# Altium project 手柄.PrjPcb
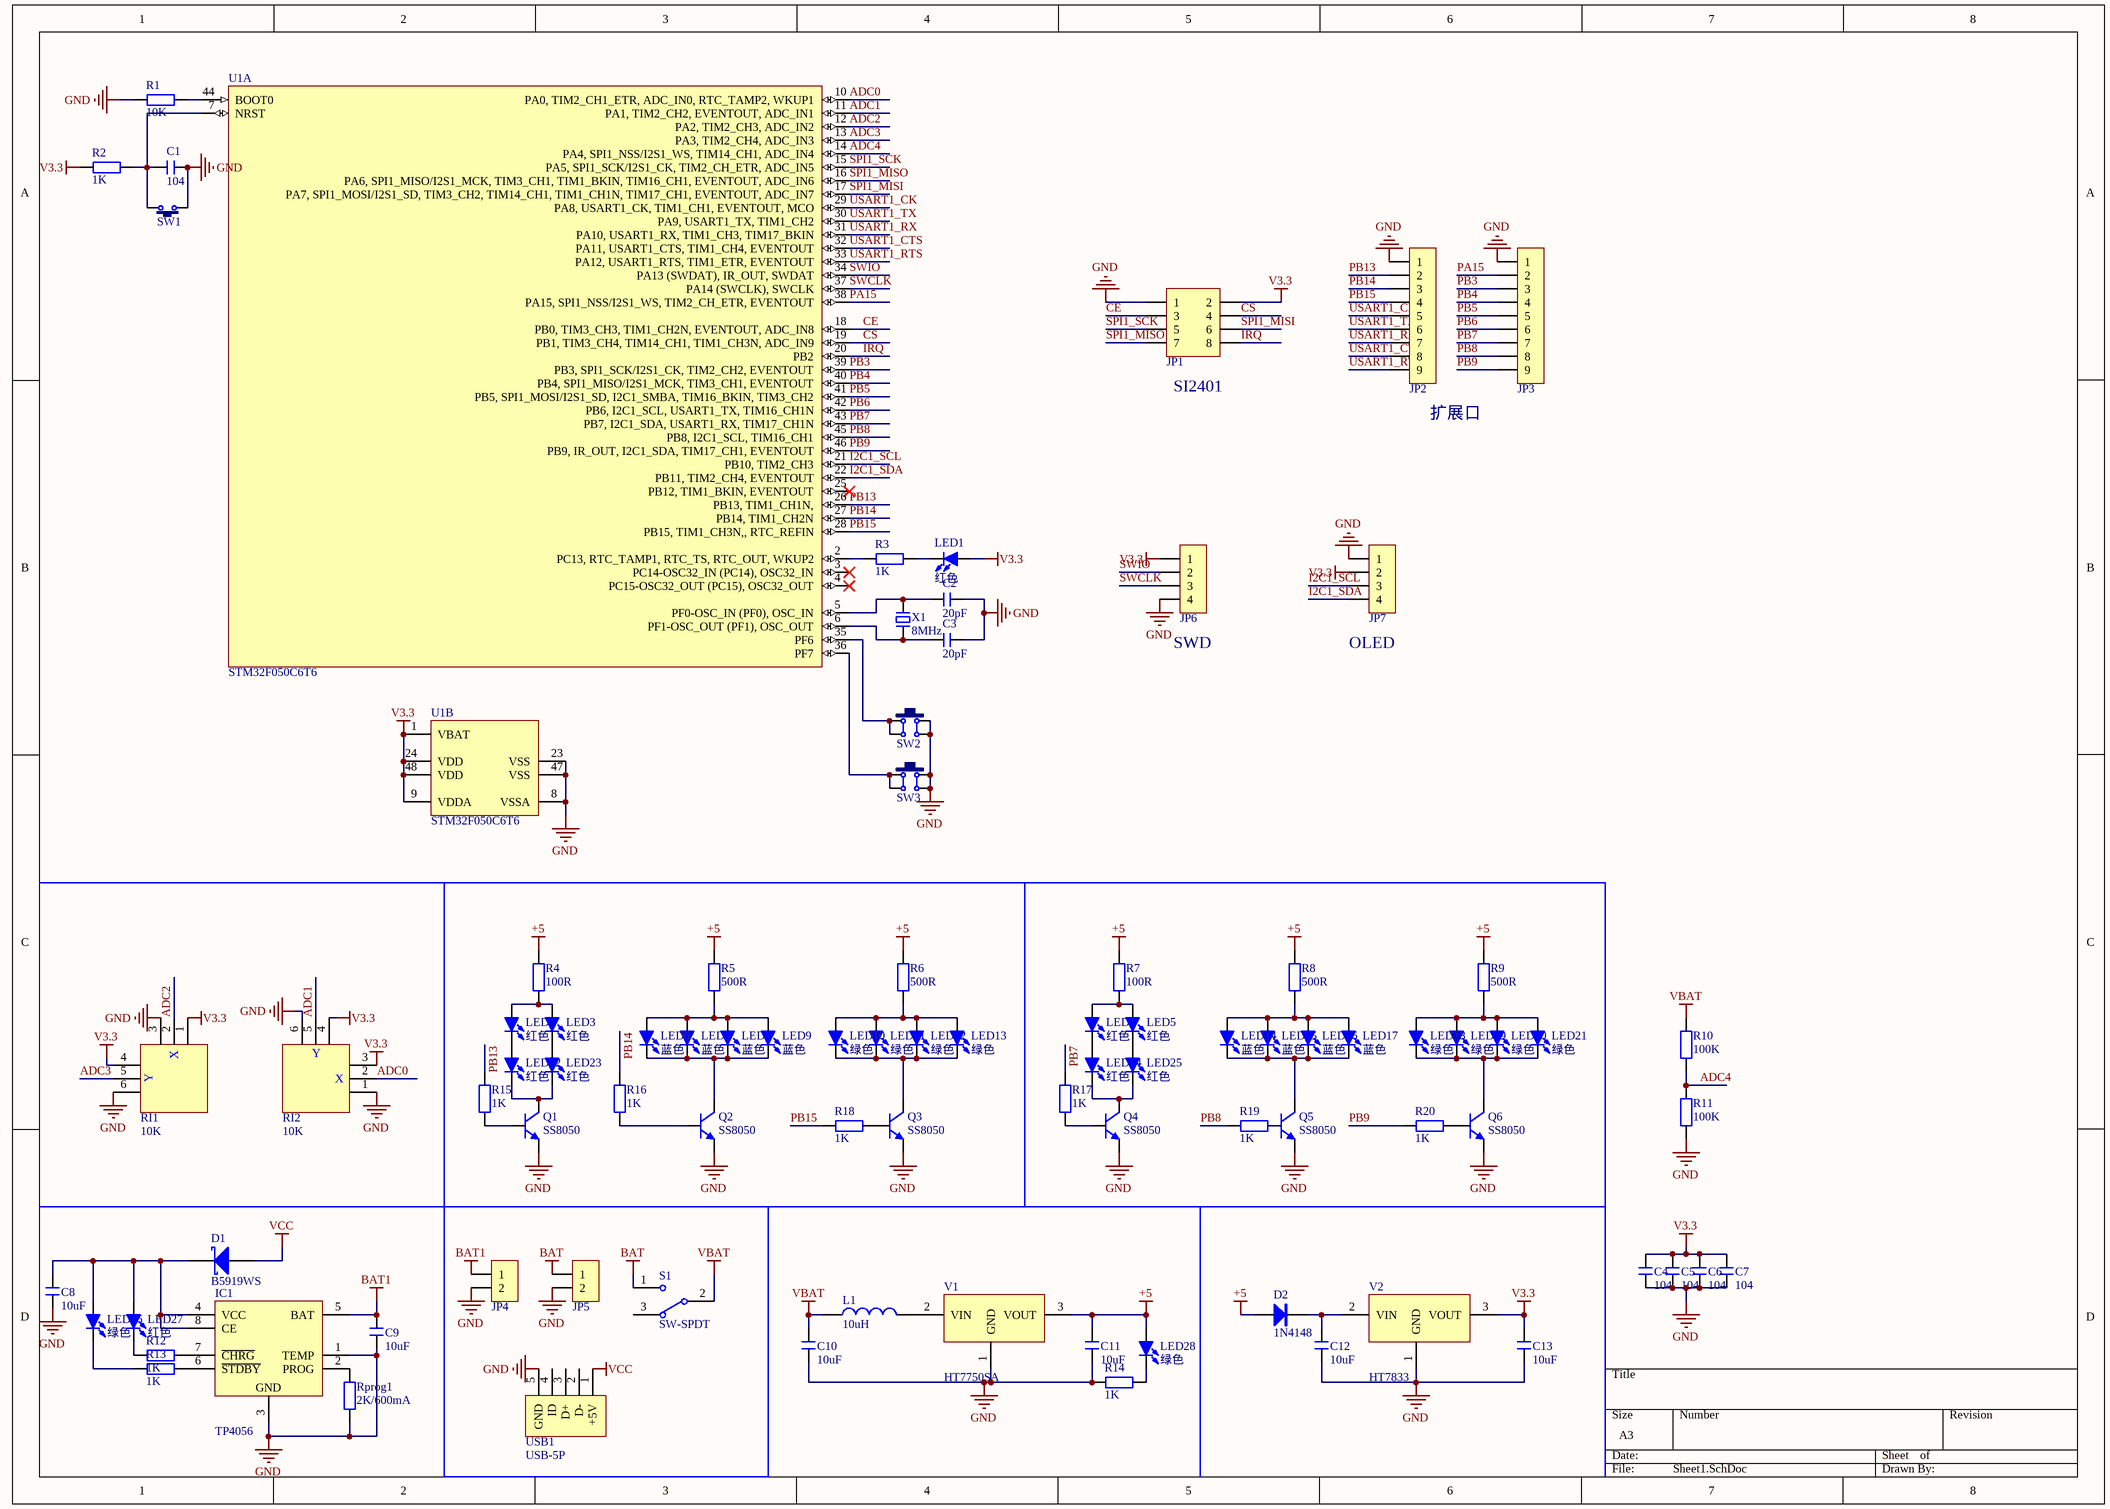
[diagram p0: Sheet1.SchDoc]
1 sheet, 90 parts. Net scope: global (net labels, ports and power ports of the same name join across sheets).
Board file: PCB1.PcbDoc

## Sheet Sheet1.SchDoc
size A3

### Parts
C1  104  [C 0603_L]
C2  20pF  [C 0805_L]
C3  20pF  [C 0805_L]
C4  104  [C 0603_L]
C5  104  [C 0603_L]
C6  104  [C 0603_L]
C7  104  [C 0603_L]
C8  10uF  [C 0603_L]
C9  10uF  [C 0603_L]
C10  10uF  [C 0603_L]
C11  10uF  [C 0603_L]
C12  10uF  [C 0603_L]
C13  10uF  [C 0603_L]
D1  B5919WS  [SOD-323]
D2  1N4148  [MINI_MELF (LL34)]
IC1  TP4056  [SOP8_N]
JP1  Header 4X2  [HDR2.54-LI-2x4P]  (value not drawn)
JP2  HDR-1X9  [HDR2.54-LI-9P]  (value not drawn)
JP3  HDR-1X9  [HDR2.54-LI-9P]  (value not drawn)
JP4  HDR-1X2  [XH2.54-LI-2P]  (value not drawn)
JP5  HDR-1X2  [XH2.54-LI-2P]  (value not drawn)
JP6  HDR-1X4  [HDR2.54-LI-4P]  (value not drawn)
JP7  HDR-1X4  [HDR2.54-M-LI-4P]  (value not drawn)
L1  10uH  [L 0805]
LED1  红色  [LED 0603R]
LED2  红色  [LED 0603R]
LED3  红色  [LED 0603R]
LED4  红色  [LED 0603R]
LED5  红色  [LED 0603R]
LED6  蓝色  [LED 0603B]
LED7  蓝色  [LED 0603B]
LED8  蓝色  [LED 0603B]
LED9  蓝色  [LED 0603B]
LED10  绿色  [LED 0603G]
LED11  绿色  [LED 0603G]
LED12  绿色  [LED 0603G]
LED13  绿色  [LED 0603G]
LED14  蓝色  [LED 0603B]
LED15  蓝色  [LED 0603B]
LED16  蓝色  [LED 0603B]
LED17  蓝色  [LED 0603B]
LED18  绿色  [LED 0603G]
LED19  绿色  [LED 0603G]
LED20  绿色  [LED 0603G]
LED21  绿色  [LED 0603G]
LED22  红色  [LED 0603R]
LED23  红色  [LED 0603R]
LED24  红色  [LED 0603R]
LED25  红色  [LED 0603R]
LED26  绿色  [LED 0603G]
LED27  红色  [LED 0603R]
LED28  绿色  [LED 0603G]
Q1  SS8050  [SOT23-3N]
Q2  SS8050  [SOT23-3N]
Q3  SS8050  [SOT23-3N]
Q4  SS8050  [SOT23-3N]
Q5  SS8050  [SOT23-3N]
Q6  SS8050  [SOT23-3N]
R1  10K  [R 0603_L]
R2  1K  [R 0603_L]
R3  1K  [R 0603_L]
R4  100R  [R 0603_L]
R5  500R  [R 0603_L]
R6  500R  [R 0603_L]
R7  100R  [R 0603_L]
R8  500R  [R 0603_L]
R9  500R  [R 0603_L]
R10  100K  [R 0603_L]
R11  100K  [R 0603_L]
R12  1K  [R 0603_L]
R13  1K  [R 0603_L]
R14  1K  [R 0603_L]
R15  1K  [R 0603_L]
R16  1K  [R 0603_L]
R17  1K  [R 0603_L]
R18  1K  [R 0603_L]
R19  1K  [R 0603_L]
R20  1K  [R 0603_L]
RI1  10K  [ROC16]
RI2  10K  [ROC16]
Rprog1  2K/600mA  [R 0603_M]
S1  SW-SPDT  [SWITCH_PWR]
SW1  3x6x5  [TSW SMD-3*6*2.5]  (value not drawn)
SW2  6x6x5  [TSW DIP-6*6*6]  (value not drawn)
SW3  6x6x5  [TSW DIP-6*6*6]  (value not drawn)
U1  STM32F050C6T6  [LQFP48_N]  (parts A,B of 2)
USB1  USB-5P  [USB-MICRO_D]
V1  HT7750SA  [SOT89_M]
V2  HT7833  [SOT89_M]
X1  8MHz  [OSC HC-49S]

### Nets
+5: C11.2 D2.1(A) LED28.1(A) R4.2 R5.2 R6.2 R7.2 R8.2 R9.2 V1.3(VOUT)
BAT: JP5.1 S1.1
BAT1: C9.2 IC1.5(BAT) JP4.1
GND: C1.1 C2.2 C3.2 C4.1 C5.1 C6.1 C7.1 C8.1 C9.1 C10.1 C11.1 C12.1 C13.1 IC1.1(TEMP) IC1.3(GND) JP1.1 JP2.1 JP3.1 JP4.2 JP5.2 JP6.4 JP7.1 Q1.2(E) Q2.2(E) Q3.2(E) Q4.2(E) Q5.2(E) Q6.2(E) R1.1 R11.1 R14.1 RI1.3 RI1.6 RI2.1 RI2.6 Rprog1.1 SW1.1 SW2.2 SW2.3 SW3.2 SW3.3 U1.8(VSSA) U1.23(VSS) U1.47(VSS) USB1.5(GND) V1.1(GND) V2.1(GND)
V3.3: C4.2 C5.2 C6.2 C7.2 C13.2 JP1.2 JP6.1 JP7.2 LED1.1(A) R2.2 RI1.1 RI1.4 RI2.3 RI2.4 U1.1(VBAT) U1.9(VDDA) U1.24(VDD) U1.48(VDD) V2.3(VOUT)
VBAT: C10.2 L1.1 R10.2 S1.2
VCC: D1.1(A) USB1.1(+5V)
ADC0: RI2.2 U1.10(PA0,_TIM2_CH1_ETR,_ADC_IN0,_RTC_TAMP2,_WKUP1)
ADC1: RI2.5 U1.11(PA1,_TIM2_CH2,_EVENTOUT,_ADC_IN1)
ADC2: RI1.2 U1.12(PA2,_TIM2_CH3,_ADC_IN2)
ADC3: RI1.5 U1.13(PA3,_TIM2_CH4,_ADC_IN3)
ADC4: R10.1 R11.2 U1.14(PA4,_SPI1_NSS/I2S1_WS,_TIM14_CH1,_ADC_IN4)
CE: JP1.3 U1.18(PB0,_TIM3_CH3,_TIM1_CH2N,_EVENTOUT,_ADC_IN8)
CS: JP1.4 U1.19(PB1,_TIM3_CH4,_TIM14_CH1,_TIM1_CH3N,_ADC_IN9)
I2C1_SCL: JP7.3 U1.21(PB10,_TIM2_CH3)
I2C1_SDA: JP7.4 U1.22(PB11,_TIM2_CH4,_EVENTOUT)
IRQ: JP1.8 U1.20(PB2)
PA15: JP3.2 U1.38(PA15,_SPI1_NSS/I2S1_WS,_TIM2_CH_ETR,_EVENTOUT)
PB3: JP3.3 U1.39(PB3,_SPI1_SCK/I2S1_CK,_TIM2_CH2,_EVENTOUT)
PB4: JP3.4 U1.40(PB4,_SPI1_MISO/I2S1_MCK,_TIM3_CH1,_EVENTOUT)
PB5: JP3.5 U1.41(PB5,_SPI1_MOSI/I2S1_SD,_I2C1_SMBA,_TIM16_BKIN,_TIM3_CH2)
PB6: JP3.6 U1.42(PB6,_I2C1_SCL,_USART1_TX,_TIM16_CH1N)
PB7: JP3.7 R17.2 U1.43(PB7,_I2C1_SDA,_USART1_RX,_TIM17_CH1N)
PB8: JP3.8 R19.2 U1.45(PB8,_I2C1_SCL,_TIM16_CH1)
PB9: JP3.9 R20.2 U1.46(PB9,_IR_OUT,_I2C1_SDA,_TIM17_CH1,_EVENTOUT)
PB13: JP2.2 R15.2 U1.26(PB13,_TIM1_CH1N,)
PB14: JP2.3 R16.2 U1.27(PB14,_TIM1_CH2N)
PB15: JP2.4 R18.2 U1.28(PB15,_TIM1_CH3N,,_RTC_REFIN)
SPI1_MISI: JP1.6 U1.17(PA7,_SPI1_MOSI/I2S1_SD,_TIM3_CH2,_TIM14_CH1,_TIM1_CH1N,_TIM17_CH1,_EVENTOUT,_ADC_IN7)
SPI1_MISO: JP1.7 U1.16(PA6,_SPI1_MISO/I2S1_MCK,_TIM3_CH1,_TIM1_BKIN,_TIM16_CH1,_EVENTOUT,_ADC_IN6)
SPI1_SCK: JP1.5 U1.15(PA5,_SPI1_SCK/I2S1_CK,_TIM2_CH_ETR,_ADC_IN5)
SWCLK: JP6.3 U1.37(PA14_(SWCLK),_SWCLK)
SWIO: JP6.2 U1.34(PA13_(SWDAT),_IR_OUT,_SWDAT)
USART1_CK: JP2.5 U1.29(PA8,_USART1_CK,_TIM1_CH1,_EVENTOUT,_MCO)
USART1_CTS: JP2.8 U1.32(PA11,_USART1_CTS,_TIM1_CH4,_EVENTOUT)
USART1_RTS: JP2.9 U1.33(PA12,_USART1_RTS,_TIM1_ETR,_EVENTOUT)
USART1_RX: JP2.7 U1.31(PA10,_USART1_RX,_TIM1_CH3,_TIM17_BKIN)
USART1_TX: JP2.6 U1.30(PA9,_USART1_TX,_TIM1_CH2)
NetC1_2: C1.2 R2.1 SW1.2 U1.7(NRST)
NetC2_1: C2.1 U1.5(PF0-OSC_IN_(PF0),_OSC_IN) X1.2
NetC3_1: C3.1 U1.6(PF1-OSC_OUT_(PF1),_OSC_OUT) X1.1
NetC8_2: C8.2 D1.2(K) IC1.4(VCC) IC1.8(CE) LED26.1(A) LED27.1(A)
NetC12_2: C12.2 D2.2(K) V2.2(VIN)
NetIC1_2: IC1.2(PROG) Rprog1.2
NetIC1_6: IC1.6(~{STDBY}) R13.2
NetIC1_7: IC1.7(~{CHRG}) R12.1
NetL1_2: L1.2 V1.2(VIN)
NetLED1_2: LED1.2(K) R3.1
NetLED2_1: LED2.1(A) LED3.1(A) R4.1
NetLED2_2: LED2.2(K) LED22.1(A)
NetLED3_2: LED3.2(K) LED23.1(A)
NetLED4_1: LED4.1(A) LED5.1(A) R7.1
NetLED4_2: LED4.2(K) LED24.1(A)
NetLED5_2: LED5.2(K) LED25.1(A)
NetLED6_1: LED6.1(A) LED7.1(A) LED8.1(A) LED9.1(A) R5.1
NetLED6_2: LED6.2(K) LED7.2(K) LED8.2(K) LED9.2(K) Q2.3(C)
NetLED10_1: LED10.1(A) LED11.1(A) LED12.1(A) LED13.1(A) R6.1
NetLED10_2: LED10.2(K) LED11.2(K) LED12.2(K) LED13.2(K) Q3.3(C)
NetLED14_1: LED14.1(A) LED15.1(A) LED16.1(A) LED17.1(A) R8.1
NetLED14_2: LED14.2(K) LED15.2(K) LED16.2(K) LED17.2(K) Q5.3(C)
NetLED18_1: LED18.1(A) LED19.1(A) LED20.1(A) LED21.1(A) R9.1
NetLED18_2: LED18.2(K) LED19.2(K) LED20.2(K) LED21.2(K) Q6.3(C)
NetLED22_2: LED22.2(K) LED23.2(K) Q1.3(C)
NetLED24_2: LED24.2(K) LED25.2(K) Q4.3(C)
NetLED26_2: LED26.2(K) R13.1
NetLED27_2: LED27.2(K) R12.2
NetLED28_2: LED28.2(K) R14.2
NetQ1_1: Q1.1(B) R15.1
NetQ2_1: Q2.1(B) R16.1
NetQ3_1: Q3.1(B) R18.1
NetQ4_1: Q4.1(B) R17.1
NetQ5_1: Q5.1(B) R19.1
NetQ6_1: Q6.1(B) R20.1
NetR1_2: R1.2 U1.44(BOOT0)
NetR3_2: R3.2 U1.2(PC13,_RTC_TAMP1,_RTC_TS,_RTC_OUT,_WKUP2)
NetSW2_1: SW2.1 SW2.4 U1.35(PF6)
NetSW3_1: SW3.1 SW3.4 U1.36(PF7)

Not connected (* = marked no-connect by the designer): S1 3; U1 3(PC14-OSC32_IN_(PC14),_OSC32_IN)* 4(PC15-OSC32_OUT_(PC15),_OSC32_OUT)* 25(PB12,_TIM1_BKIN,_EVENTOUT)*; USB1 2(D-) 3(D+) 4(ID)

### Notes on the sheet
- (near JP1) SI2401
- (near JP2) 扩展口
- (near JP6) SWD
- (near JP7) OLED
- (in symbol ROC16B) X; Y

### Library data of the parts
C1-C13 = C: 贴片电容; BOM名称: 无极性贴片电容; 淘宝ID: 封装库来自淘宝 ID：黄晶宝石; 联系售后: https://shop463601444.taobao.com
D1 = 1N5819: 肖特基二极管; 淘宝ID: 封装库来自淘宝 ID：黄晶宝石; 属性: 40V/2A; BOM名称: 肖特基二极管; 欢迎光临: https://shop463601444.taobao.com
D2 = 1N4148: 开关二极管; BOM名称: 高速开关二极管; 淘宝ID: 封装库来自淘宝 ID：黄晶宝石; 欢迎光临: https://shop463601444.taobao.com
IC1 = TP4056: 锂电池充电管理; 淘宝ID: 封装库来自淘宝 ID：黄晶宝石; BOM名称: 锂电池充电管理; 学习资源: https://shop463601444.taobao.com
JP1 = Header 4X2: 4*2P接插件; 版权归属: 封装库来自淘宝 ID：黄晶宝石; BOM名称: 4*2P接插件; 学习资源: https://shop463601444.taobao.com
JP2 JP3 = Header 9: 9P接插件; 版权归属: 源创客; BOM名称: 9P接插件; 学习资源: www.ooocke.com
JP4 JP5 = Header 2: 2P接插件; 版权归属: 封装库来自淘宝 ID：黄晶宝石; BOM名称: 2P接插件; 联系售后: https://shop463601444.taobao.com
JP6 JP7 = Header 4: 4P接插件; 版权归属: 封装库来自淘宝 ID：黄晶宝石; BOM名称: 4P接插件; 学习资源: https://shop463601444.taobao.com
L1 = L: 小功率贴片电感; 淘宝ID: 封装库来自淘宝 ID：黄晶宝石; BOM名称: 小功率贴片电感; 联系售后: https://shop463601444.taobao.com
LED1-LED28 = LED-SMD: 贴片LED; 版权归属: 封装库来自淘宝 ID：黄晶宝石; BOM名称: 贴片LED; 学习资源: https://shop463601444.taobao.com
Q1-Q6 = 8050-SMD: 高频放大-NPN型; 版权归属: 封装库来自淘宝 ID：黄晶宝石; 属性: 40V 1.5A 1W 100MHZ; BOM名称: 高频放大-NPN型; 联系售后: https://shop463601444.taobao.com
R1-R20 Rprog1 = R: 贴片电阻; 版权归属: 来自淘宝 ID：黄晶宝石; BOM名称: 贴片电阻; 联系售后: https://shop463601444.taobao.com
RI1 RI2 = ROC16B: 摇杆电位器; 版权归属: 封装库来自淘宝 ID：黄晶宝石; BOM名称: 摇杆电位器; 学习资源: https://shop463601444.taobao.com
S1 = SW-SPDT: SPDT Subminiature Toggle Switch, Right Angle Mounting, Vertical Actuation; Published: 10-August-2017; PackageReference: SWITCH_PWR; Publisher: mazhongwei
SW1 = TSW 3x6: 3x6轻触开关; 版权归属: 封装库来自淘宝 ID：黄晶宝石; BOM名称: 3x6轻触开关; 学习资源: www.ooocke.com
SW2 SW3 = TSW DIP-6x6: 直插6x6轻触开关; 版权归属: 封装库来自淘宝 ID：黄晶宝石; BOM名称: 直插6x6轻触开关; 学习资源: https://shop463601444.taobao.com
U1 = STM32F050C6T6: ARM Cortex-M0 32-bit RISC core (48 MHz max), 32kB Flash, 4 kB Internal RAM, 39 High Current I/Os, -40 to +85癈, 48-Pin LQFP, Tray; 16-bit timers (IC/OC/PWM): 5x16-bit; 32-bit timer (IC/OC/PWM): 1x32-bit; Other timer functions: 2 x WDG, RTC, 24-bit down counter; A/D Converter: 10x12-bit; Serial Interface: 1xSPI;1xI2S;1xI2C;1xUSART(IrDA, ISO 7816); Supply Current(Icc) (Lowest power mode) typ (礎): 1.65; Supply Current(Icc) (Run mode (per Mhz)) typ (礎): 250; DatasheetVersion: rev2, Feb-2012; PackageVersion: rev13, Apr-2011; PackageReference: LQFP48; PackageDescription: 48-Pin Low-Profile Quad Flat Pack, 7 x 7 mm Body, 0.5 mm Pitch (LQFP48); ComponentLink1Description: Manufacturer URL; ComponentLink1URL: https://shop463601444.taobao.com; ComponentLink2Description: Datasheet; ComponentLink2URL: http://www.st.com/internet/com/TECHNICAL_RESOURCES/TECHNICAL_LITERATURE/DATA_BRIEF/DM00047078.pdf; ComponentLink3Description: STM32F0 Web Page; ComponentLink3URL: http://www.st.com/internet/mcu/subclass/1588.jsp
USB1 = USB-5P: 微型USB母座; BOM名称: 微型USB母座; 学习资源: https://shop463601444.taobao.com
V1 V2 = HT71xx: LDO线性稳压芯片; 版权归属: 封装库来自淘宝 ID：黄晶宝石; BOM名称: LDO线性稳压芯片; 学习资源: https://shop463601444.taobao.com
X1 = XTAL-2P: 2脚无源脚晶振; 版权归属: 源创客; BOM名称: 2脚无源脚晶振; 学习资源: www.ooocke.com